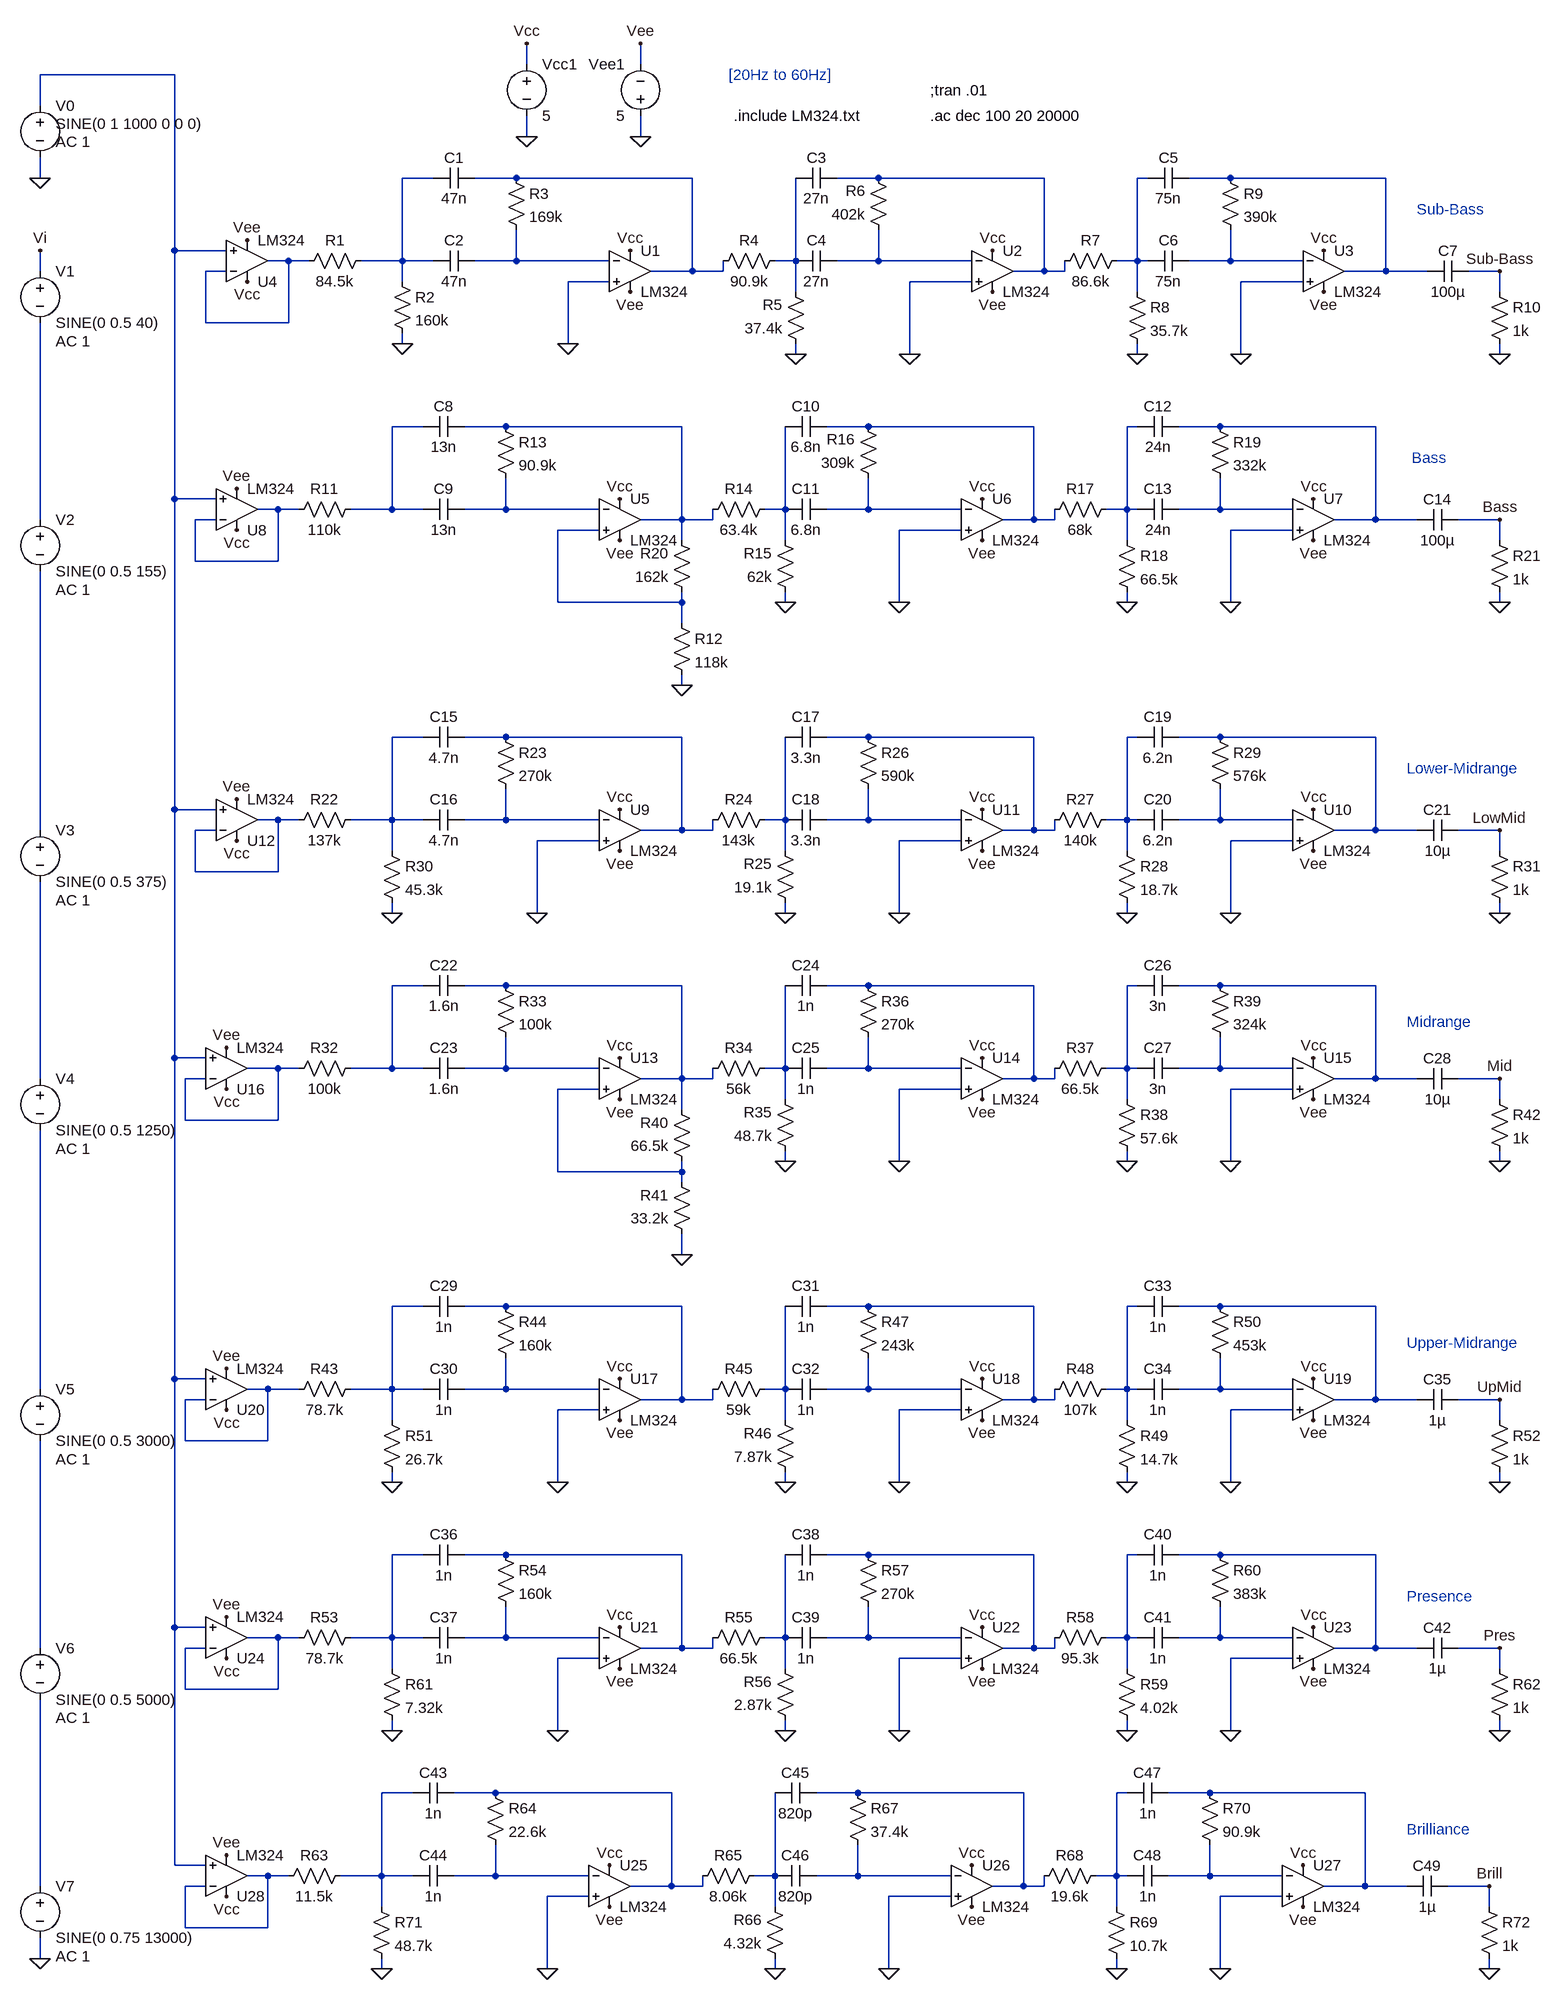
[diagram p0: schematic AllFiltersBuf.asc]
AllFiltersBuf.asc, the LTspice schematic file:
Version 4
SHEET 1 2152 2500
WIRE 576 -464 576 -496
WIRE 752 -464 752 -496
WIRE 32 -448 -176 -448
WIRE -176 -400 -176 -448
WIRE 576 -352 576 -384
WIRE 752 -352 752 -384
WIRE -176 -288 -176 -320
WIRE 432 -288 384 -288
WIRE 560 -288 496 -288
WIRE 832 -288 560 -288
WIRE 1120 -288 1056 -288
WIRE 1376 -288 1120 -288
WIRE 1536 -288 1520 -288
WIRE 1664 -288 1600 -288
WIRE 1904 -288 1664 -288
WIRE 32 -176 32 -448
WIRE 112 -176 32 -176
WIRE 208 -160 176 -160
WIRE 240 -160 208 -160
WIRE 384 -160 384 -288
WIRE 384 -160 320 -160
WIRE 432 -160 384 -160
WIRE 560 -160 560 -208
WIRE 560 -160 496 -160
WIRE 704 -160 560 -160
WIRE 992 -160 992 -288
WIRE 992 -160 960 -160
WIRE 1120 -160 1120 -208
WIRE 1120 -160 1056 -160
WIRE 1264 -160 1120 -160
WIRE 1520 -160 1520 -288
WIRE 1520 -160 1488 -160
WIRE 1536 -160 1520 -160
WIRE 1664 -160 1664 -208
WIRE 1664 -160 1600 -160
WIRE 1776 -160 1664 -160
WIRE -176 -144 -176 -176
WIRE 112 -144 80 -144
WIRE 832 -144 832 -288
WIRE 832 -144 768 -144
WIRE 880 -144 880 -160
WIRE 880 -144 832 -144
WIRE 1376 -144 1376 -288
WIRE 1376 -144 1328 -144
WIRE 1408 -144 1408 -160
WIRE 1408 -144 1376 -144
WIRE 1904 -144 1904 -288
WIRE 1904 -144 1840 -144
WIRE 1968 -144 1904 -144
WIRE 2080 -144 2032 -144
WIRE 384 -128 384 -160
WIRE 704 -128 640 -128
WIRE 1264 -128 1168 -128
WIRE 1776 -128 1680 -128
WIRE 992 -112 992 -160
WIRE 1520 -112 1520 -160
WIRE 2080 -112 2080 -144
WIRE 80 -64 80 -144
WIRE 208 -64 208 -160
WIRE 208 -64 80 -64
WIRE 384 -32 384 -48
WIRE 640 -32 640 -128
WIRE 992 -16 992 -32
WIRE 1168 -16 1168 -128
WIRE 1520 -16 1520 -32
WIRE 1680 -16 1680 -128
WIRE 2080 -16 2080 -32
WIRE 416 96 368 96
WIRE 544 96 480 96
WIRE 816 96 544 96
WIRE 1104 96 1040 96
WIRE 1360 96 1104 96
WIRE 1520 96 1504 96
WIRE 1648 96 1584 96
WIRE 1888 96 1648 96
WIRE 32 208 32 -176
WIRE 96 208 32 208
WIRE 192 224 160 224
WIRE 224 224 192 224
WIRE 368 224 368 96
WIRE 368 224 304 224
WIRE 416 224 368 224
WIRE 544 224 544 176
WIRE 544 224 480 224
WIRE 688 224 544 224
WIRE 976 224 976 96
WIRE 976 224 944 224
WIRE 1104 224 1104 176
WIRE 1104 224 1040 224
WIRE 1248 224 1104 224
WIRE 1504 224 1504 96
WIRE 1504 224 1472 224
WIRE 1520 224 1504 224
WIRE 1648 224 1648 176
WIRE 1648 224 1584 224
WIRE 1760 224 1648 224
WIRE -176 240 -176 -64
WIRE 96 240 64 240
WIRE 816 240 816 96
WIRE 816 240 752 240
WIRE 864 240 864 224
WIRE 864 240 816 240
WIRE 1360 240 1360 96
WIRE 1360 240 1312 240
WIRE 1392 240 1392 224
WIRE 1392 240 1360 240
WIRE 1888 240 1888 96
WIRE 1888 240 1824 240
WIRE 1952 240 1888 240
WIRE 2080 240 2016 240
WIRE 688 256 624 256
WIRE 1248 256 1152 256
WIRE 1760 256 1664 256
WIRE 816 272 816 240
WIRE 976 272 976 224
WIRE 1504 272 1504 224
WIRE 2080 272 2080 240
WIRE 64 304 64 240
WIRE 192 304 192 224
WIRE 192 304 64 304
WIRE 624 368 624 256
WIRE 816 368 816 352
WIRE 816 368 624 368
WIRE 976 368 976 352
WIRE 1152 368 1152 256
WIRE 1504 368 1504 352
WIRE 1664 368 1664 256
WIRE 2080 368 2080 352
WIRE 816 400 816 368
WIRE 816 496 816 480
WIRE 416 576 368 576
WIRE 544 576 480 576
WIRE 816 576 544 576
WIRE 1104 576 1040 576
WIRE 1360 576 1104 576
WIRE 1520 576 1504 576
WIRE 1648 576 1584 576
WIRE 1888 576 1648 576
WIRE 32 688 32 208
WIRE 96 688 32 688
WIRE 192 704 160 704
WIRE 224 704 192 704
WIRE 368 704 368 576
WIRE 368 704 304 704
WIRE 416 704 368 704
WIRE 544 704 544 656
WIRE 544 704 480 704
WIRE 688 704 544 704
WIRE 976 704 976 576
WIRE 976 704 944 704
WIRE 1104 704 1104 656
WIRE 1104 704 1040 704
WIRE 1248 704 1104 704
WIRE 1504 704 1504 576
WIRE 1504 704 1472 704
WIRE 1520 704 1504 704
WIRE 1648 704 1648 656
WIRE 1648 704 1584 704
WIRE 1760 704 1648 704
WIRE -176 720 -176 320
WIRE 96 720 64 720
WIRE 816 720 816 576
WIRE 816 720 752 720
WIRE 864 720 864 704
WIRE 864 720 816 720
WIRE 1360 720 1360 576
WIRE 1360 720 1312 720
WIRE 1392 720 1392 704
WIRE 1392 720 1360 720
WIRE 1888 720 1888 576
WIRE 1888 720 1824 720
WIRE 1952 720 1888 720
WIRE 2080 720 2016 720
WIRE 688 736 592 736
WIRE 1248 736 1152 736
WIRE 1760 736 1664 736
WIRE 368 752 368 704
WIRE 976 752 976 704
WIRE 1504 752 1504 704
WIRE 2080 752 2080 720
WIRE 64 784 64 720
WIRE 192 784 192 704
WIRE 192 784 64 784
WIRE 368 848 368 832
WIRE 592 848 592 736
WIRE 976 848 976 832
WIRE 1152 848 1152 736
WIRE 1504 848 1504 832
WIRE 1664 848 1664 736
WIRE 2080 848 2080 832
WIRE 416 960 368 960
WIRE 544 960 480 960
WIRE 816 960 544 960
WIRE 1104 960 1040 960
WIRE 1360 960 1104 960
WIRE 1520 960 1504 960
WIRE 1648 960 1584 960
WIRE 1888 960 1648 960
WIRE 32 1072 32 688
WIRE 80 1072 32 1072
WIRE 192 1088 144 1088
WIRE 224 1088 192 1088
WIRE 368 1088 368 960
WIRE 368 1088 304 1088
WIRE 416 1088 368 1088
WIRE 544 1088 544 1040
WIRE 544 1088 480 1088
WIRE 688 1088 544 1088
WIRE 976 1088 976 960
WIRE 976 1088 944 1088
WIRE 1104 1088 1104 1040
WIRE 1104 1088 1040 1088
WIRE 1248 1088 1104 1088
WIRE 1504 1088 1504 960
WIRE 1504 1088 1472 1088
WIRE 1520 1088 1504 1088
WIRE 1648 1088 1648 1040
WIRE 1648 1088 1584 1088
WIRE 1760 1088 1648 1088
WIRE -176 1104 -176 800
WIRE 80 1104 48 1104
WIRE 816 1104 816 960
WIRE 816 1104 752 1104
WIRE 864 1104 864 1088
WIRE 864 1104 816 1104
WIRE 1360 1104 1360 960
WIRE 1360 1104 1312 1104
WIRE 1392 1104 1392 1088
WIRE 1392 1104 1360 1104
WIRE 1888 1104 1888 960
WIRE 1888 1104 1824 1104
WIRE 1952 1104 1888 1104
WIRE 2080 1104 2016 1104
WIRE 688 1120 624 1120
WIRE 1248 1120 1152 1120
WIRE 1760 1120 1664 1120
WIRE 976 1136 976 1088
WIRE 1504 1136 1504 1088
WIRE 2080 1136 2080 1104
WIRE 816 1152 816 1104
WIRE 48 1168 48 1104
WIRE 192 1168 192 1088
WIRE 192 1168 48 1168
WIRE 976 1232 976 1216
WIRE 1152 1232 1152 1120
WIRE 1504 1232 1504 1216
WIRE 1664 1232 1664 1120
WIRE 2080 1232 2080 1216
WIRE 624 1248 624 1120
WIRE 816 1248 816 1232
WIRE 816 1248 624 1248
WIRE 816 1264 816 1248
WIRE 816 1376 816 1344
WIRE 416 1456 368 1456
WIRE 544 1456 480 1456
WIRE 816 1456 544 1456
WIRE 1104 1456 1040 1456
WIRE 1360 1456 1104 1456
WIRE 1520 1456 1504 1456
WIRE 1648 1456 1584 1456
WIRE 1888 1456 1648 1456
WIRE 32 1568 32 1072
WIRE 80 1568 32 1568
WIRE -176 1584 -176 1184
WIRE 176 1584 144 1584
WIRE 224 1584 176 1584
WIRE 368 1584 368 1456
WIRE 368 1584 304 1584
WIRE 416 1584 368 1584
WIRE 544 1584 544 1536
WIRE 544 1584 480 1584
WIRE 688 1584 544 1584
WIRE 976 1584 976 1456
WIRE 976 1584 944 1584
WIRE 1104 1584 1104 1536
WIRE 1104 1584 1040 1584
WIRE 1248 1584 1104 1584
WIRE 1504 1584 1504 1456
WIRE 1504 1584 1472 1584
WIRE 1520 1584 1504 1584
WIRE 1648 1584 1648 1536
WIRE 1648 1584 1584 1584
WIRE 1760 1584 1648 1584
WIRE 80 1600 48 1600
WIRE 816 1600 816 1456
WIRE 816 1600 752 1600
WIRE 864 1600 864 1584
WIRE 864 1600 816 1600
WIRE 1360 1600 1360 1456
WIRE 1360 1600 1312 1600
WIRE 1392 1600 1392 1584
WIRE 1392 1600 1360 1600
WIRE 1888 1600 1888 1456
WIRE 1888 1600 1824 1600
WIRE 1952 1600 1888 1600
WIRE 2080 1600 2016 1600
WIRE 688 1616 624 1616
WIRE 1248 1616 1152 1616
WIRE 1760 1616 1664 1616
WIRE 368 1632 368 1584
WIRE 976 1632 976 1584
WIRE 1504 1632 1504 1584
WIRE 2080 1632 2080 1600
WIRE 48 1664 48 1600
WIRE 176 1664 176 1584
WIRE 176 1664 48 1664
WIRE 368 1728 368 1712
WIRE 624 1728 624 1616
WIRE 976 1728 976 1712
WIRE 1152 1728 1152 1616
WIRE 1504 1728 1504 1712
WIRE 1664 1728 1664 1616
WIRE 2080 1728 2080 1712
WIRE 416 1840 368 1840
WIRE 544 1840 480 1840
WIRE 816 1840 544 1840
WIRE 1104 1840 1040 1840
WIRE 1360 1840 1104 1840
WIRE 1520 1840 1504 1840
WIRE 1648 1840 1584 1840
WIRE 1888 1840 1648 1840
WIRE 32 1952 32 1568
WIRE 80 1952 32 1952
WIRE 192 1968 144 1968
WIRE 224 1968 192 1968
WIRE 368 1968 368 1840
WIRE 368 1968 304 1968
WIRE 416 1968 368 1968
WIRE 544 1968 544 1920
WIRE 544 1968 480 1968
WIRE 688 1968 544 1968
WIRE 976 1968 976 1840
WIRE 976 1968 944 1968
WIRE 1104 1968 1104 1920
WIRE 1104 1968 1040 1968
WIRE 1248 1968 1104 1968
WIRE 1504 1968 1504 1840
WIRE 1504 1968 1472 1968
WIRE 1520 1968 1504 1968
WIRE 1648 1968 1648 1920
WIRE 1648 1968 1584 1968
WIRE 1760 1968 1648 1968
WIRE -176 1984 -176 1664
WIRE 80 1984 48 1984
WIRE 816 1984 816 1840
WIRE 816 1984 752 1984
WIRE 864 1984 864 1968
WIRE 864 1984 816 1984
WIRE 1360 1984 1360 1840
WIRE 1360 1984 1312 1984
WIRE 1392 1984 1392 1968
WIRE 1392 1984 1360 1984
WIRE 1888 1984 1888 1840
WIRE 1888 1984 1824 1984
WIRE 1952 1984 1888 1984
WIRE 2080 1984 2016 1984
WIRE 688 2000 624 2000
WIRE 1248 2000 1152 2000
WIRE 1760 2000 1664 2000
WIRE 368 2016 368 1968
WIRE 976 2016 976 1968
WIRE 1504 2016 1504 1968
WIRE 2080 2016 2080 1984
WIRE 48 2048 48 1984
WIRE 192 2048 192 1968
WIRE 192 2048 48 2048
WIRE 368 2112 368 2096
WIRE 624 2112 624 2000
WIRE 976 2112 976 2096
WIRE 1152 2112 1152 2000
WIRE 1504 2112 1504 2096
WIRE 1664 2112 1664 2000
WIRE 2080 2112 2080 2096
WIRE 400 2208 352 2208
WIRE 528 2208 464 2208
WIRE 800 2208 528 2208
WIRE 1088 2208 1024 2208
WIRE 1344 2208 1088 2208
WIRE 1504 2208 1488 2208
WIRE 1632 2208 1568 2208
WIRE 1872 2208 1632 2208
WIRE 32 2320 32 1952
WIRE 80 2320 32 2320
WIRE 176 2336 144 2336
WIRE 208 2336 176 2336
WIRE 352 2336 352 2208
WIRE 352 2336 288 2336
WIRE 400 2336 352 2336
WIRE 528 2336 528 2288
WIRE 528 2336 464 2336
WIRE 672 2336 528 2336
WIRE 960 2336 960 2208
WIRE 960 2336 928 2336
WIRE 1088 2336 1088 2288
WIRE 1088 2336 1024 2336
WIRE 1232 2336 1088 2336
WIRE 1488 2336 1488 2208
WIRE 1488 2336 1456 2336
WIRE 1504 2336 1488 2336
WIRE 1632 2336 1632 2288
WIRE 1632 2336 1568 2336
WIRE 1744 2336 1632 2336
WIRE -176 2352 -176 2064
WIRE 80 2352 48 2352
WIRE 800 2352 800 2208
WIRE 800 2352 736 2352
WIRE 848 2352 848 2336
WIRE 848 2352 800 2352
WIRE 1344 2352 1344 2208
WIRE 1344 2352 1296 2352
WIRE 1376 2352 1376 2336
WIRE 1376 2352 1344 2352
WIRE 1872 2352 1872 2208
WIRE 1872 2352 1808 2352
WIRE 1936 2352 1872 2352
WIRE 2064 2352 2000 2352
WIRE 672 2368 608 2368
WIRE 1232 2368 1136 2368
WIRE 1744 2368 1648 2368
WIRE 352 2384 352 2336
WIRE 960 2384 960 2336
WIRE 1488 2384 1488 2336
WIRE 2064 2384 2064 2352
WIRE 48 2416 48 2352
WIRE 176 2416 176 2336
WIRE 176 2416 48 2416
WIRE -176 2464 -176 2432
WIRE 352 2480 352 2464
WIRE 608 2480 608 2368
WIRE 960 2480 960 2464
WIRE 1136 2480 1136 2368
WIRE 1488 2480 1488 2464
WIRE 1648 2480 1648 2368
WIRE 2064 2480 2064 2464
FLAG 1168 -16 0
FLAG -176 -176 Vi
FLAG 1680 -16 0
FLAG 1520 -16 0
FLAG 992 -16 0
FLAG 384 -32 0
FLAG 640 -32 0
FLAG 736 -112 Vee
FLAG 736 -176 Vcc
FLAG 1296 -112 Vee
FLAG 1296 -176 Vcc
FLAG 1808 -112 Vee
FLAG 1808 -176 Vcc
FLAG 576 -496 Vcc
FLAG 576 -352 0
FLAG 752 -352 0
FLAG 752 -496 Vee
FLAG 2080 -16 0
FLAG 2080 -144 Sub-Bass
FLAG 144 -192 Vee
FLAG 144 -128 Vcc
FLAG 1152 368 0
FLAG 1664 368 0
FLAG 1504 368 0
FLAG 976 368 0
FLAG 816 496 0
FLAG 720 272 Vee
FLAG 720 208 Vcc
FLAG 1280 272 Vee
FLAG 1280 208 Vcc
FLAG 1792 272 Vee
FLAG 1792 208 Vcc
FLAG 2080 368 0
FLAG 2080 240 Bass
FLAG 128 192 Vee
FLAG 128 256 Vcc
FLAG 1152 848 0
FLAG 1664 848 0
FLAG 1504 848 0
FLAG 976 848 0
FLAG 592 848 0
FLAG 368 848 0
FLAG 720 752 Vee
FLAG 720 688 Vcc
FLAG 1792 752 Vee
FLAG 1792 688 Vcc
FLAG 1280 752 Vee
FLAG 1280 688 Vcc
FLAG 2080 848 0
FLAG 2080 720 LowMid
FLAG 128 672 Vee
FLAG 128 736 Vcc
FLAG 1152 1232 0
FLAG 1664 1232 0
FLAG 1504 1232 0
FLAG 976 1232 0
FLAG 816 1376 0
FLAG 720 1136 Vee
FLAG 720 1072 Vcc
FLAG 1280 1136 Vee
FLAG 1280 1072 Vcc
FLAG 1792 1136 Vee
FLAG 1792 1072 Vcc
FLAG 2080 1232 0
FLAG 2080 1104 Mid
FLAG 112 1056 Vee
FLAG 112 1120 Vcc
FLAG 1152 1728 0
FLAG 1664 1728 0
FLAG 1504 1728 0
FLAG 976 1728 0
FLAG 368 1728 0
FLAG 624 1728 0
FLAG 720 1632 Vee
FLAG 720 1568 Vcc
FLAG 1280 1632 Vee
FLAG 1280 1568 Vcc
FLAG 1792 1632 Vee
FLAG 1792 1568 Vcc
FLAG 2080 1728 0
FLAG 2080 1600 UpMid
FLAG 112 1552 Vee
FLAG 112 1616 Vcc
FLAG 1152 2112 0
FLAG 1664 2112 0
FLAG 1504 2112 0
FLAG 976 2112 0
FLAG 368 2112 0
FLAG 624 2112 0
FLAG 720 2016 Vee
FLAG 720 1952 Vcc
FLAG 1280 2016 Vee
FLAG 1280 1952 Vcc
FLAG 1792 2016 Vee
FLAG 1792 1952 Vcc
FLAG 2080 2112 0
FLAG 2080 1984 Pres
FLAG 112 1936 Vee
FLAG 112 2000 Vcc
FLAG 1136 2480 0
FLAG -176 2464 0
FLAG 1648 2480 0
FLAG 1488 2480 0
FLAG 960 2480 0
FLAG 352 2480 0
FLAG 608 2480 0
FLAG 704 2384 Vee
FLAG 704 2320 Vcc
FLAG 1264 2384 Vee
FLAG 1264 2320 Vcc
FLAG 1776 2384 Vee
FLAG 1776 2320 Vcc
FLAG 2064 2480 0
FLAG 2064 2352 Brill
FLAG 112 2304 Vee
FLAG 112 2368 Vcc
FLAG -176 -288 0
SYMBOL res 336 -176 R90
WINDOW 0 0 56 VBottom 2
WINDOW 3 32 56 VTop 2
SYMATTR InstName R1
SYMATTR Value 84.5k
SYMBOL voltage -176 -160 R0
WINDOW 123 24 124 Left 2
WINDOW 39 0 0 Left 0
SYMATTR Value2 AC 1
SYMATTR InstName V1
SYMATTR Value SINE(0 0.5 40)
SYMBOL res 368 -144 R0
SYMATTR InstName R2
SYMATTR Value 160k
SYMBOL res 544 -304 R0
SYMATTR InstName R3
SYMATTR Value 169k
SYMBOL res 976 -176 R90
WINDOW 0 0 56 VBottom 2
WINDOW 3 32 56 VTop 2
SYMATTR InstName R4
SYMATTR Value 90.9k
SYMBOL res 1008 -16 R180
WINDOW 0 36 76 Left 2
WINDOW 3 36 40 Left 2
SYMATTR InstName R5
SYMATTR Value 37.4k
SYMBOL res 1136 -192 R180
WINDOW 0 36 76 Left 2
WINDOW 3 36 40 Left 2
SYMATTR InstName R6
SYMATTR Value 402k
SYMBOL res 1392 -144 R270
WINDOW 0 32 56 VTop 2
WINDOW 3 0 56 VBottom 2
SYMATTR InstName R7
SYMATTR Value 86.6k
SYMBOL res 1504 -128 R0
SYMATTR InstName R8
SYMATTR Value 35.7k
SYMBOL res 1648 -304 R0
SYMATTR InstName R9
SYMATTR Value 390k
SYMBOL cap 496 -304 R90
WINDOW 0 0 32 VBottom 2
WINDOW 3 32 32 VTop 2
SYMATTR InstName C1
SYMATTR Value 47n
SYMBOL cap 496 -176 R90
WINDOW 0 0 32 VBottom 2
WINDOW 3 32 32 VTop 2
SYMATTR InstName C2
SYMATTR Value 47n
SYMBOL cap 1056 -304 R90
WINDOW 0 0 32 VBottom 2
WINDOW 3 32 32 VTop 2
SYMATTR InstName C3
SYMATTR Value 27n
SYMBOL cap 1056 -176 R90
WINDOW 0 0 32 VBottom 2
WINDOW 3 32 32 VTop 2
SYMATTR InstName C4
SYMATTR Value 27n
SYMBOL cap 1600 -304 R90
WINDOW 0 0 32 VBottom 2
WINDOW 3 32 32 VTop 2
SYMATTR InstName C5
SYMATTR Value 75n
SYMBOL cap 1600 -176 R90
WINDOW 0 0 32 VBottom 2
WINDOW 3 32 32 VTop 2
SYMATTR InstName C6
SYMATTR Value 75n
SYMBOL OpAmps\\opamp2 736 -208 R0
SYMATTR InstName U1
SYMATTR Value LM324
SYMBOL OpAmps\\opamp2 1296 -208 R0
SYMATTR InstName U2
SYMATTR Value LM324
SYMBOL OpAmps\\opamp2 1808 -208 R0
SYMATTR InstName U3
SYMATTR Value LM324
SYMBOL voltage 576 -480 R0
WINDOW 123 0 0 Left 0
WINDOW 39 0 0 Left 0
SYMATTR InstName Vcc1
SYMATTR Value 5
SYMBOL voltage 752 -368 R180
WINDOW 0 24 96 Left 2
WINDOW 3 24 16 Left 2
WINDOW 123 0 0 Left 0
WINDOW 39 0 0 Left 0
SYMATTR InstName Vee1
SYMATTR Value 5
SYMBOL cap 2032 -160 R90
WINDOW 0 0 32 VBottom 2
WINDOW 3 32 32 VTop 2
SYMATTR InstName C7
SYMATTR Value 100µ
SYMBOL res 2064 -128 R0
SYMATTR InstName R10
SYMATTR Value 1k
SYMBOL OpAmps\\opamp2 144 -96 M180
SYMATTR InstName U4
SYMATTR Value LM324
SYMBOL res 320 208 R90
WINDOW 0 0 56 VBottom 2
WINDOW 3 32 56 VTop 2
SYMATTR InstName R11
SYMATTR Value 110k
SYMBOL voltage -176 224 R0
WINDOW 123 24 124 Left 2
WINDOW 39 0 0 Left 0
SYMATTR Value2 AC 1
SYMATTR InstName V2
SYMATTR Value SINE(0 0.5 155)
SYMBOL res 800 384 R0
SYMATTR InstName R12
SYMATTR Value 118k
SYMBOL res 528 80 R0
SYMATTR InstName R13
SYMATTR Value 90.9k
SYMBOL res 960 208 R90
WINDOW 0 0 56 VBottom 2
WINDOW 3 32 56 VTop 2
SYMATTR InstName R14
SYMATTR Value 63.4k
SYMBOL res 992 368 R180
WINDOW 0 36 76 Left 2
WINDOW 3 36 40 Left 2
SYMATTR InstName R15
SYMATTR Value 62k
SYMBOL res 1120 192 R180
WINDOW 0 36 76 Left 2
WINDOW 3 36 40 Left 2
SYMATTR InstName R16
SYMATTR Value 309k
SYMBOL res 1376 240 R270
WINDOW 0 32 56 VTop 2
WINDOW 3 0 56 VBottom 2
SYMATTR InstName R17
SYMATTR Value 68k
SYMBOL res 1488 256 R0
SYMATTR InstName R18
SYMATTR Value 66.5k
SYMBOL res 1632 80 R0
SYMATTR InstName R19
SYMATTR Value 332k
SYMBOL cap 480 80 R90
WINDOW 0 0 32 VBottom 2
WINDOW 3 32 32 VTop 2
SYMATTR InstName C8
SYMATTR Value 13n
SYMBOL cap 480 208 R90
WINDOW 0 0 32 VBottom 2
WINDOW 3 32 32 VTop 2
SYMATTR InstName C9
SYMATTR Value 13n
SYMBOL cap 1040 80 R90
WINDOW 0 0 32 VBottom 2
WINDOW 3 32 32 VTop 2
SYMATTR InstName C10
SYMATTR Value 6.8n
SYMBOL cap 1040 208 R90
WINDOW 0 0 32 VBottom 2
WINDOW 3 32 32 VTop 2
SYMATTR InstName C11
SYMATTR Value 6.8n
SYMBOL cap 1584 80 R90
WINDOW 0 0 32 VBottom 2
WINDOW 3 32 32 VTop 2
SYMATTR InstName C12
SYMATTR Value 24n
SYMBOL cap 1584 208 R90
WINDOW 0 0 32 VBottom 2
WINDOW 3 32 32 VTop 2
SYMATTR InstName C13
SYMATTR Value 24n
SYMBOL res 832 368 R180
WINDOW 0 36 76 Left 2
WINDOW 3 36 40 Left 2
SYMATTR InstName R20
SYMATTR Value 162k
SYMBOL OpAmps\\opamp2 720 176 R0
SYMATTR InstName U5
SYMATTR Value LM324
SYMBOL OpAmps\\opamp2 1280 176 R0
SYMATTR InstName U6
SYMATTR Value LM324
SYMBOL OpAmps\\opamp2 1792 176 R0
SYMATTR InstName U7
SYMATTR Value LM324
SYMBOL cap 2016 224 R90
WINDOW 0 0 32 VBottom 2
WINDOW 3 32 32 VTop 2
SYMATTR InstName C14
SYMATTR Value 100µ
SYMBOL res 2064 256 R0
SYMATTR InstName R21
SYMATTR Value 1k
SYMBOL OpAmps\\opamp2 128 288 M180
SYMATTR InstName U8
SYMATTR Value LM324
SYMBOL res 320 688 R90
WINDOW 0 0 56 VBottom 2
WINDOW 3 32 56 VTop 2
SYMATTR InstName R22
SYMATTR Value 137k
SYMBOL voltage -176 704 R0
WINDOW 123 24 124 Left 2
WINDOW 39 0 0 Left 0
SYMATTR Value2 AC 1
SYMATTR InstName V3
SYMATTR Value SINE(0 0.5 375)
SYMBOL res 528 560 R0
SYMATTR InstName R23
SYMATTR Value 270k
SYMBOL res 960 688 R90
WINDOW 0 0 56 VBottom 2
WINDOW 3 32 56 VTop 2
SYMATTR InstName R24
SYMATTR Value 143k
SYMBOL res 992 848 R180
WINDOW 0 36 76 Left 2
WINDOW 3 36 40 Left 2
SYMATTR InstName R25
SYMATTR Value 19.1k
SYMBOL res 1088 560 R0
SYMATTR InstName R26
SYMATTR Value 590k
SYMBOL res 1376 720 R270
WINDOW 0 32 56 VTop 2
WINDOW 3 0 56 VBottom 2
SYMATTR InstName R27
SYMATTR Value 140k
SYMBOL res 1488 736 R0
SYMATTR InstName R28
SYMATTR Value 18.7k
SYMBOL res 1632 560 R0
SYMATTR InstName R29
SYMATTR Value 576k
SYMBOL cap 480 560 R90
WINDOW 0 0 32 VBottom 2
WINDOW 3 32 32 VTop 2
SYMATTR InstName C15
SYMATTR Value 4.7n
SYMBOL cap 480 688 R90
WINDOW 0 0 32 VBottom 2
WINDOW 3 32 32 VTop 2
SYMATTR InstName C16
SYMATTR Value 4.7n
SYMBOL cap 1040 560 R90
WINDOW 0 0 32 VBottom 2
WINDOW 3 32 32 VTop 2
SYMATTR InstName C17
SYMATTR Value 3.3n
SYMBOL cap 1040 688 R90
WINDOW 0 0 32 VBottom 2
WINDOW 3 32 32 VTop 2
SYMATTR InstName C18
SYMATTR Value 3.3n
SYMBOL cap 1584 560 R90
WINDOW 0 0 32 VBottom 2
WINDOW 3 32 32 VTop 2
SYMATTR InstName C19
SYMATTR Value 6.2n
SYMBOL cap 1584 688 R90
WINDOW 0 0 32 VBottom 2
WINDOW 3 32 32 VTop 2
SYMATTR InstName C20
SYMATTR Value 6.2n
SYMBOL res 352 736 R0
SYMATTR InstName R30
SYMATTR Value 45.3k
SYMBOL OpAmps\\opamp2 720 656 R0
SYMATTR InstName U9
SYMATTR Value LM324
SYMBOL OpAmps\\opamp2 1792 656 R0
SYMATTR InstName U10
SYMATTR Value LM324
SYMBOL OpAmps\\opamp2 1280 656 R0
SYMATTR InstName U11
SYMATTR Value LM324
SYMBOL cap 2016 704 R90
WINDOW 0 0 32 VBottom 2
WINDOW 3 32 32 VTop 2
SYMATTR InstName C21
SYMATTR Value 10µ
SYMBOL res 2064 736 R0
SYMATTR InstName R31
SYMATTR Value 1k
SYMBOL OpAmps\\opamp2 128 768 M180
SYMATTR InstName U12
SYMATTR Value LM324
SYMBOL res 320 1072 R90
WINDOW 0 0 56 VBottom 2
WINDOW 3 32 56 VTop 2
SYMATTR InstName R32
SYMATTR Value 100k
SYMBOL voltage -176 1088 R0
WINDOW 123 24 124 Left 2
WINDOW 39 0 0 Left 0
SYMATTR Value2 AC 1
SYMATTR InstName V4
SYMATTR Value SINE(0 0.5 1250)
SYMBOL res 528 944 R0
SYMATTR InstName R33
SYMATTR Value 100k
SYMBOL res 960 1072 R90
WINDOW 0 0 56 VBottom 2
WINDOW 3 32 56 VTop 2
SYMATTR InstName R34
SYMATTR Value 56k
SYMBOL res 992 1232 R180
WINDOW 0 36 76 Left 2
WINDOW 3 36 40 Left 2
SYMATTR InstName R35
SYMATTR Value 48.7k
SYMBOL res 1088 944 R0
SYMATTR InstName R36
SYMATTR Value 270k
SYMBOL res 1376 1104 R270
WINDOW 0 32 56 VTop 2
WINDOW 3 0 56 VBottom 2
SYMATTR InstName R37
SYMATTR Value 66.5k
SYMBOL res 1488 1120 R0
SYMATTR InstName R38
SYMATTR Value 57.6k
SYMBOL res 1632 944 R0
SYMATTR InstName R39
SYMATTR Value 324k
SYMBOL cap 480 944 R90
WINDOW 0 0 32 VBottom 2
WINDOW 3 32 32 VTop 2
SYMATTR InstName C22
SYMATTR Value 1.6n
SYMBOL cap 480 1072 R90
WINDOW 0 0 32 VBottom 2
WINDOW 3 32 32 VTop 2
SYMATTR InstName C23
SYMATTR Value 1.6n
SYMBOL cap 1040 944 R90
WINDOW 0 0 32 VBottom 2
WINDOW 3 32 32 VTop 2
SYMATTR InstName C24
SYMATTR Value 1n
SYMBOL cap 1040 1072 R90
WINDOW 0 0 32 VBottom 2
WINDOW 3 32 32 VTop 2
SYMATTR InstName C25
SYMATTR Value 1n
SYMBOL cap 1584 944 R90
WINDOW 0 0 32 VBottom 2
WINDOW 3 32 32 VTop 2
SYMATTR InstName C26
SYMATTR Value 3n
SYMBOL cap 1584 1072 R90
WINDOW 0 0 32 VBottom 2
WINDOW 3 32 32 VTop 2
SYMATTR InstName C27
SYMATTR Value 3n
SYMBOL res 832 1248 R180
WINDOW 0 36 76 Left 2
WINDOW 3 36 40 Left 2
SYMATTR InstName R40
SYMATTR Value 66.5k
SYMBOL res 832 1360 R180
WINDOW 0 36 76 Left 2
WINDOW 3 36 40 Left 2
SYMATTR InstName R41
SYMATTR Value 33.2k
SYMBOL OpAmps\\opamp2 720 1040 R0
SYMATTR InstName U13
SYMATTR Value LM324
SYMBOL OpAmps\\opamp2 1280 1040 R0
SYMATTR InstName U14
SYMATTR Value LM324
SYMBOL OpAmps\\opamp2 1792 1040 R0
SYMATTR InstName U15
SYMATTR Value LM324
SYMBOL cap 2016 1088 R90
WINDOW 0 0 32 VBottom 2
WINDOW 3 32 32 VTop 2
SYMATTR InstName C28
SYMATTR Value 10µ
SYMBOL res 2064 1120 R0
SYMATTR InstName R42
SYMATTR Value 1k
SYMBOL OpAmps\\opamp2 112 1152 M180
SYMATTR InstName U16
SYMATTR Value LM324
SYMBOL res 320 1568 R90
WINDOW 0 0 56 VBottom 2
WINDOW 3 32 56 VTop 2
SYMATTR InstName R43
SYMATTR Value 78.7k
SYMBOL voltage -176 1568 R0
WINDOW 123 24 124 Left 2
WINDOW 39 0 0 Left 0
SYMATTR Value2 AC 1
SYMATTR InstName V5
SYMATTR Value SINE(0 0.5 3000)
SYMBOL res 528 1440 R0
SYMATTR InstName R44
SYMATTR Value 160k
SYMBOL res 960 1568 R90
WINDOW 0 0 56 VBottom 2
WINDOW 3 32 56 VTop 2
SYMATTR InstName R45
SYMATTR Value 59k
SYMBOL res 992 1728 R180
WINDOW 0 36 76 Left 2
WINDOW 3 36 40 Left 2
SYMATTR InstName R46
SYMATTR Value 7.87k
SYMBOL res 1088 1440 R0
SYMATTR InstName R47
SYMATTR Value 243k
SYMBOL res 1376 1600 R270
WINDOW 0 32 56 VTop 2
WINDOW 3 0 56 VBottom 2
SYMATTR InstName R48
SYMATTR Value 107k
SYMBOL res 1488 1616 R0
SYMATTR InstName R49
SYMATTR Value 14.7k
SYMBOL res 1632 1440 R0
SYMATTR InstName R50
SYMATTR Value 453k
SYMBOL cap 480 1440 R90
WINDOW 0 0 32 VBottom 2
WINDOW 3 32 32 VTop 2
SYMATTR InstName C29
SYMATTR Value 1n
SYMBOL cap 480 1568 R90
WINDOW 0 0 32 VBottom 2
WINDOW 3 32 32 VTop 2
SYMATTR InstName C30
SYMATTR Value 1n
SYMBOL cap 1040 1440 R90
WINDOW 0 0 32 VBottom 2
WINDOW 3 32 32 VTop 2
SYMATTR InstName C31
SYMATTR Value 1n
SYMBOL cap 1040 1568 R90
WINDOW 0 0 32 VBottom 2
WINDOW 3 32 32 VTop 2
SYMATTR InstName C32
SYMATTR Value 1n
SYMBOL cap 1584 1440 R90
WINDOW 0 0 32 VBottom 2
WINDOW 3 32 32 VTop 2
SYMATTR InstName C33
SYMATTR Value 1n
SYMBOL cap 1584 1568 R90
WINDOW 0 0 32 VBottom 2
WINDOW 3 32 32 VTop 2
SYMATTR InstName C34
SYMATTR Value 1n
SYMBOL res 352 1616 R0
SYMATTR InstName R51
SYMATTR Value 26.7k
SYMBOL OpAmps\\opamp2 720 1536 R0
SYMATTR InstName U17
SYMATTR Value LM324
SYMBOL OpAmps\\opamp2 1280 1536 R0
SYMATTR InstName U18
SYMATTR Value LM324
SYMBOL OpAmps\\opamp2 1792 1536 R0
SYMATTR InstName U19
SYMATTR Value LM324
SYMBOL cap 2016 1584 R90
WINDOW 0 0 32 VBottom 2
WINDOW 3 32 32 VTop 2
SYMATTR InstName C35
SYMATTR Value 1µ
SYMBOL res 2064 1616 R0
SYMATTR InstName R52
SYMATTR Value 1k
SYMBOL OpAmps\\opamp2 112 1648 M180
SYMATTR InstName U20
SYMATTR Value LM324
SYMBOL res 320 1952 R90
WINDOW 0 0 56 VBottom 2
WINDOW 3 32 56 VTop 2
SYMATTR InstName R53
SYMATTR Value 78.7k
SYMBOL voltage -176 1968 R0
WINDOW 123 24 124 Left 2
WINDOW 39 0 0 Left 0
SYMATTR Value2 AC 1
SYMATTR InstName V6
SYMATTR Value SINE(0 0.5 5000)
SYMBOL res 528 1824 R0
SYMATTR InstName R54
SYMATTR Value 160k
SYMBOL res 960 1952 R90
WINDOW 0 0 56 VBottom 2
WINDOW 3 32 56 VTop 2
SYMATTR InstName R55
SYMATTR Value 66.5k
SYMBOL res 992 2112 R180
WINDOW 0 36 76 Left 2
WINDOW 3 36 40 Left 2
SYMATTR InstName R56
SYMATTR Value 2.87k
SYMBOL res 1088 1824 R0
SYMATTR InstName R57
SYMATTR Value 270k
SYMBOL res 1376 1984 R270
WINDOW 0 32 56 VTop 2
WINDOW 3 0 56 VBottom 2
SYMATTR InstName R58
SYMATTR Value 95.3k
SYMBOL res 1488 2000 R0
SYMATTR InstName R59
SYMATTR Value 4.02k
SYMBOL res 1632 1824 R0
SYMATTR InstName R60
SYMATTR Value 383k
SYMBOL cap 480 1824 R90
WINDOW 0 0 32 VBottom 2
WINDOW 3 32 32 VTop 2
SYMATTR InstName C36
SYMATTR Value 1n
SYMBOL cap 480 1952 R90
WINDOW 0 0 32 VBottom 2
WINDOW 3 32 32 VTop 2
SYMATTR InstName C37
SYMATTR Value 1n
SYMBOL cap 1040 1824 R90
WINDOW 0 0 32 VBottom 2
WINDOW 3 32 32 VTop 2
SYMATTR InstName C38
SYMATTR Value 1n
SYMBOL cap 1040 1952 R90
WINDOW 0 0 32 VBottom 2
WINDOW 3 32 32 VTop 2
SYMATTR InstName C39
SYMATTR Value 1n
SYMBOL cap 1584 1824 R90
WINDOW 0 0 32 VBottom 2
WINDOW 3 32 32 VTop 2
SYMATTR InstName C40
SYMATTR Value 1n
SYMBOL cap 1584 1952 R90
WINDOW 0 0 32 VBottom 2
WINDOW 3 32 32 VTop 2
SYMATTR InstName C41
SYMATTR Value 1n
SYMBOL res 352 2000 R0
SYMATTR InstName R61
SYMATTR Value 7.32k
SYMBOL OpAmps\\opamp2 720 1920 R0
SYMATTR InstName U21
SYMATTR Value LM324
SYMBOL OpAmps\\opamp2 1280 1920 R0
SYMATTR InstName U22
SYMATTR Value LM324
SYMBOL OpAmps\\opamp2 1792 1920 R0
SYMATTR InstName U23
SYMATTR Value LM324
SYMBOL cap 2016 1968 R90
WINDOW 0 0 32 VBottom 2
WINDOW 3 32 32 VTop 2
SYMATTR InstName C42
SYMATTR Value 1µ
SYMBOL res 2064 2000 R0
SYMATTR InstName R62
SYMATTR Value 1k
SYMBOL OpAmps\\opamp2 112 2032 M180
SYMATTR InstName U24
SYMATTR Value LM324
SYMBOL res 304 2320 R90
WINDOW 0 0 56 VBottom 2
WINDOW 3 32 56 VTop 2
SYMATTR InstName R63
SYMATTR Value 11.5k
SYMBOL voltage -176 2336 R0
WINDOW 123 24 124 Left 2
WINDOW 39 0 0 Left 0
SYMATTR Value2 AC 1
SYMATTR InstName V7
SYMATTR Value SINE(0 0.75 13000)
SYMBOL res 512 2192 R0
SYMATTR InstName R64
SYMATTR Value 22.6k
SYMBOL res 944 2320 R90
WINDOW 0 0 56 VBottom 2
WINDOW 3 32 56 VTop 2
SYMATTR InstName R65
SYMATTR Value 8.06k
SYMBOL res 976 2480 R180
WINDOW 0 36 76 Left 2
WINDOW 3 36 40 Left 2
SYMATTR InstName R66
SYMATTR Value 4.32k
SYMBOL res 1072 2192 R0
SYMATTR InstName R67
SYMATTR Value 37.4k
SYMBOL res 1360 2352 R270
WINDOW 0 32 56 VTop 2
WINDOW 3 0 56 VBottom 2
SYMATTR InstName R68
SYMATTR Value 19.6k
SYMBOL res 1472 2368 R0
SYMATTR InstName R69
SYMATTR Value 10.7k
SYMBOL res 1616 2192 R0
SYMATTR InstName R70
SYMATTR Value 90.9k
SYMBOL cap 464 2192 R90
WINDOW 0 0 32 VBottom 2
WINDOW 3 32 32 VTop 2
SYMATTR InstName C43
SYMATTR Value 1n
SYMBOL cap 464 2320 R90
WINDOW 0 0 32 VBottom 2
WINDOW 3 32 32 VTop 2
SYMATTR InstName C44
SYMATTR Value 1n
SYMBOL cap 1024 2192 R90
WINDOW 0 0 32 VBottom 2
WINDOW 3 32 32 VTop 2
SYMATTR InstName C45
SYMATTR Value 820p
SYMBOL cap 1024 2320 R90
WINDOW 0 0 32 VBottom 2
WINDOW 3 32 32 VTop 2
SYMATTR InstName C46
SYMATTR Value 820p
SYMBOL cap 1568 2192 R90
WINDOW 0 0 32 VBottom 2
WINDOW 3 32 32 VTop 2
SYMATTR InstName C47
SYMATTR Value 1n
SYMBOL cap 1568 2320 R90
WINDOW 0 0 32 VBottom 2
WINDOW 3 32 32 VTop 2
SYMATTR InstName C48
SYMATTR Value 1n
SYMBOL res 336 2368 R0
SYMATTR InstName R71
SYMATTR Value 48.7k
SYMBOL OpAmps\\opamp2 704 2288 R0
SYMATTR InstName U25
SYMATTR Value LM324
SYMBOL OpAmps\\opamp2 1264 2288 R0
SYMATTR InstName U26
SYMATTR Value LM324
SYMBOL OpAmps\\opamp2 1776 2288 R0
SYMATTR InstName U27
SYMATTR Value LM324
SYMBOL cap 2000 2336 R90
WINDOW 0 0 32 VBottom 2
WINDOW 3 32 32 VTop 2
SYMATTR InstName C49
SYMATTR Value 1µ
SYMBOL res 2048 2368 R0
SYMATTR InstName R72
SYMATTR Value 1k
SYMBOL OpAmps\\opamp2 112 2400 M180
SYMATTR InstName U28
SYMATTR Value LM324
SYMBOL voltage -176 -416 R0
WINDOW 3 24 44 Left 2
WINDOW 123 24 72 Left 2
WINDOW 39 0 0 Left 0
SYMATTR InstName V0
SYMATTR Value SINE(0 1 1000 0 0 0)
SYMATTR Value2 AC 1
TEXT 1200 -424 Left 2 !;tran .01
TEXT 1200 -384 Left 2 !.ac dec 100 20 20000
TEXT 888 -448 Left 2 ;[20Hz to 60Hz]
TEXT 896 -384 Left 2 !.include LM324.txt
TEXT 1952 -240 Left 2 ;Sub-Bass
TEXT 1944 144 Left 2 ;Bass
TEXT 1936 624 Left 2 ;Lower-Midrange
TEXT 1936 1016 Left 2 ;Midrange
TEXT 1936 1512 Left 2 ;Upper-Midrange
TEXT 1936 1904 Left 2 ;Presence
TEXT 1936 2264 Left 2 ;Brilliance

The netlist it stands for:
* AllFiltersBuf.asc
R1 N002 N007 84.5k
V1 Vi N022 SINE(0 0.5 40) AC 1
R2 N002 0 160k
R3 N003 N008 169k
R4 N009 N003 90.9k
R5 0 N009 37.4k
R6 N010 N004 402k
R7 N004 N005 86.6k
R8 N005 0 35.7k
R9 N006 N011 390k
C1 N003 N002 47n
C2 N008 N002 47n
C3 N004 N009 27n
C4 N010 N009 27n
C5 N006 N005 75n
C6 N011 N005 75n
XU1 0 N008 Vcc Vee N003 LM324  ; pins In+ In- V+ V- OUT
XU2 0 N010 Vcc Vee N004 LM324  ; pins In+ In- V+ V- OUT
XU3 0 N011 Vcc Vee N006 LM324  ; pins In+ In- V+ V- OUT
Vcc1 Vcc 0 5
Vee1 0 Vee 5
C7 Sub-Bass N006 100µ
R10 Sub-Bass 0 1k
XU4 N001 N007 Vcc Vee N007 LM324  ; pins In+ In- V+ V- OUT
R11 N012 N017 110k
V2 N022 N034 SINE(0 0.5 155) AC 1
R12 N023 0 118k
R13 N013 N018 90.9k
R14 N019 N013 63.4k
R15 0 N019 62k
R16 N020 N014 309k
R17 N014 N015 68k
R18 N015 0 66.5k
R19 N016 N021 332k
C8 N013 N012 13n
C9 N018 N012 13n
C10 N014 N019 6.8n
C11 N020 N019 6.8n
C12 N016 N015 24n
C13 N021 N015 24n
R20 N023 N013 162k
XU5 N023 N018 Vcc Vee N013 LM324  ; pins In+ In- V+ V- OUT
XU6 0 N020 Vcc Vee N014 LM324  ; pins In+ In- V+ V- OUT
XU7 0 N021 Vcc Vee N016 LM324  ; pins In+ In- V+ V- OUT
C14 Bass N016 100µ
R21 Bass 0 1k
XU8 N001 N017 Vcc Vee N017 LM324  ; pins In+ In- V+ V- OUT
R22 N024 N029 137k
V3 N034 N045 SINE(0 0.5 375) AC 1
R23 N025 N030 270k
R24 N031 N025 143k
R25 0 N031 19.1k
R26 N026 N032 590k
R27 N026 N027 140k
R28 N027 0 18.7k
R29 N028 N033 576k
C15 N025 N024 4.7n
C16 N030 N024 4.7n
C17 N026 N031 3.3n
C18 N032 N031 3.3n
C19 N028 N027 6.2n
C20 N033 N027 6.2n
R30 N024 0 45.3k
XU9 0 N030 Vcc Vee N025 LM324  ; pins In+ In- V+ V- OUT
XU10 0 N033 Vcc Vee N028 LM324  ; pins In+ In- V+ V- OUT
XU11 0 N032 Vcc Vee N026 LM324  ; pins In+ In- V+ V- OUT
C21 LowMid N028 10µ
R31 LowMid 0 1k
XU12 N001 N029 Vcc Vee N029 LM324  ; pins In+ In- V+ V- OUT
R32 N035 N040 100k
V4 N045 N052 SINE(0 0.5 1250) AC 1
R33 N036 N041 100k
R34 N042 N036 56k
R35 0 N042 48.7k
R36 N037 N043 270k
R37 N037 N038 66.5k
R38 N038 0 57.6k
R39 N039 N044 324k
C22 N036 N035 1.6n
C23 N041 N035 1.6n
C24 N037 N042 1n
C25 N043 N042 1n
C26 N039 N038 3n
C27 N044 N038 3n
R40 N046 N036 66.5k
R41 0 N046 33.2k
XU13 N046 N041 Vcc Vee N036 LM324  ; pins In+ In- V+ V- OUT
XU14 0 N043 Vcc Vee N037 LM324  ; pins In+ In- V+ V- OUT
XU15 0 N044 Vcc Vee N039 LM324  ; pins In+ In- V+ V- OUT
C28 Mid N039 10µ
R42 Mid 0 1k
XU16 N001 N040 Vcc Vee N040 LM324  ; pins In+ In- V+ V- OUT
R43 N047 N053 78.7k
V5 N052 N068 SINE(0 0.5 3000) AC 1
R44 N048 N054 160k
R45 N055 N048 59k
R46 0 N055 7.87k
R47 N049 N056 243k
R48 N049 N050 107k
R49 N050 0 14.7k
R50 N051 N057 453k
C29 N048 N047 1n
C30 N054 N047 1n
C31 N049 N055 1n
C32 N056 N055 1n
C33 N051 N050 1n
C34 N057 N050 1n
R51 N047 0 26.7k
XU17 0 N054 Vcc Vee N048 LM324  ; pins In+ In- V+ V- OUT
XU18 0 N056 Vcc Vee N049 LM324  ; pins In+ In- V+ V- OUT
XU19 0 N057 Vcc Vee N051 LM324  ; pins In+ In- V+ V- OUT
C35 UpMid N051 1µ
R52 UpMid 0 1k
XU20 N001 N053 Vcc Vee N053 LM324  ; pins In+ In- V+ V- OUT
R53 N058 N063 78.7k
V6 N068 N079 SINE(0 0.5 5000) AC 1
R54 N059 N064 160k
R55 N065 N059 66.5k
R56 0 N065 2.87k
R57 N060 N066 270k
R58 N060 N061 95.3k
R59 N061 0 4.02k
R60 N062 N067 383k
C36 N059 N058 1n
C37 N064 N058 1n
C38 N060 N065 1n
C39 N066 N065 1n
C40 N062 N061 1n
C41 N067 N061 1n
R61 N058 0 7.32k
XU21 0 N064 Vcc Vee N059 LM324  ; pins In+ In- V+ V- OUT
XU22 0 N066 Vcc Vee N060 LM324  ; pins In+ In- V+ V- OUT
XU23 0 N067 Vcc Vee N062 LM324  ; pins In+ In- V+ V- OUT
C42 Pres N062 1µ
R62 Pres 0 1k
XU24 N001 N063 Vcc Vee N063 LM324  ; pins In+ In- V+ V- OUT
R63 N069 N074 11.5k
V7 N079 0 SINE(0 0.75 13000) AC 1
R64 N070 N075 22.6k
R65 N076 N070 8.06k
R66 0 N076 4.32k
R67 N071 N077 37.4k
R68 N071 N072 19.6k
R69 N072 0 10.7k
R70 N073 N078 90.9k
C43 N070 N069 1n
C44 N075 N069 1n
C45 N071 N076 820p
C46 N077 N076 820p
C47 N073 N072 1n
C48 N078 N072 1n
R71 N069 0 48.7k
XU25 0 N075 Vcc Vee N070 LM324  ; pins In+ In- V+ V- OUT
XU26 0 N077 Vcc Vee N071 LM324  ; pins In+ In- V+ V- OUT
XU27 0 N078 Vcc Vee N073 LM324  ; pins In+ In- V+ V- OUT
C49 Brill N073 1µ
R72 Brill 0 1k
XU28 N001 N074 Vcc Vee N074 LM324  ; pins In+ In- V+ V- OUT
V0 N001 0 SINE(0 1 1000 0 0 0) AC 1
;tran .01
.ac dec 100 20 20000
* [20Hz to 60Hz]
.include LM324.txt
* Sub-Bass
* Bass
* Lower-Midrange
* Midrange
* Upper-Midrange
* Presence
* Brilliance
.backanno
.end